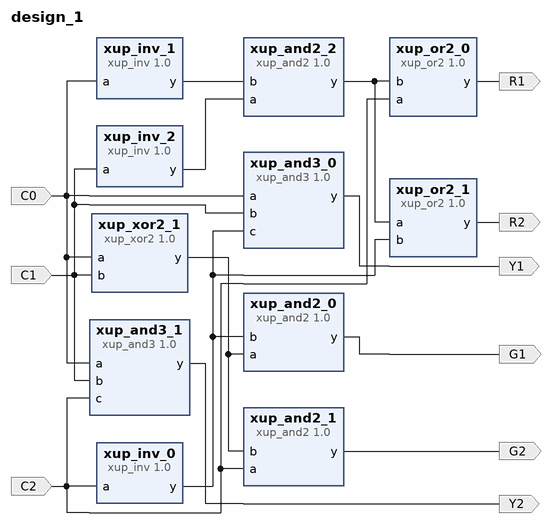
[diagram p0: block diagram of the top level]
# Vivado block design design_1, xc7a35tcpg236-1, Vivado 2023.2
create_bd_design design_1

create_bd_port -dir I C0
create_bd_port -dir I C1
create_bd_port -dir I C2
create_bd_port -dir O G1
create_bd_port -dir O G2
create_bd_port -dir O Y1
create_bd_port -dir O Y2
create_bd_port -dir O R1
create_bd_port -dir O R2

create_bd_cell -type ip -vlnv xilinx.com:xup:xup_inv:1.0 xup_inv_0
create_bd_cell -type ip -vlnv xilinx.com:xup:xup_and2:1.0 xup_and2_0
create_bd_cell -type ip -vlnv xilinx.com:xup:xup_xor2:1.0 xup_xor2_1
create_bd_cell -type ip -vlnv xilinx.com:xup:xup_and2:1.0 xup_and2_1
create_bd_cell -type ip -vlnv xilinx.com:xup:xup_and3:1.0 xup_and3_0
create_bd_cell -type ip -vlnv xilinx.com:xup:xup_and3:1.0 xup_and3_1
create_bd_cell -type ip -vlnv xilinx.com:xup:xup_inv:1.0 xup_inv_1
create_bd_cell -type ip -vlnv xilinx.com:xup:xup_inv:1.0 xup_inv_2
create_bd_cell -type ip -vlnv xilinx.com:xup:xup_and2:1.0 xup_and2_2
create_bd_cell -type ip -vlnv xilinx.com:xup:xup_or2:1.0 xup_or2_0
create_bd_cell -type ip -vlnv xilinx.com:xup:xup_or2:1.0 xup_or2_1

# ---- connections ----

connect_bd_net -net a_0_1 [get_bd_ports C0] [get_bd_pins xup_xor2_1/a] [get_bd_pins xup_and3_0/a] [get_bd_pins xup_and3_1/a] [get_bd_pins xup_inv_1/a]
connect_bd_net -net a_0_2 [get_bd_ports C2] [get_bd_pins xup_inv_0/a] [get_bd_pins xup_and2_1/a] [get_bd_pins xup_and3_1/c] [get_bd_pins xup_or2_0/a]
connect_bd_net -net b_0_1 [get_bd_ports C1] [get_bd_pins xup_xor2_1/b] [get_bd_pins xup_and3_0/b] [get_bd_pins xup_and3_1/b] [get_bd_pins xup_inv_2/a]
connect_bd_net [get_bd_pins xup_and2_0/y] [get_bd_ports G1]
connect_bd_net [get_bd_pins xup_and2_1/y] [get_bd_ports G2]
connect_bd_net [get_bd_pins xup_and2_2/y] [get_bd_pins xup_or2_0/b] [get_bd_pins xup_or2_1/a]
connect_bd_net [get_bd_pins xup_and3_0/y] [get_bd_ports Y1]
connect_bd_net [get_bd_pins xup_and3_1/y] [get_bd_ports Y2]
connect_bd_net [get_bd_pins xup_inv_0/y] [get_bd_pins xup_and2_0/b] [get_bd_pins xup_and3_0/c] [get_bd_pins xup_or2_1/b]
connect_bd_net [get_bd_pins xup_inv_1/y] [get_bd_pins xup_and2_2/b]
connect_bd_net [get_bd_pins xup_inv_2/y] [get_bd_pins xup_and2_2/a]
connect_bd_net [get_bd_pins xup_or2_0/y] [get_bd_ports R1]
connect_bd_net [get_bd_pins xup_or2_1/y] [get_bd_ports R2]
connect_bd_net [get_bd_pins xup_xor2_1/y] [get_bd_pins xup_and2_1/b] [get_bd_pins xup_and2_0/a]

validate_bd_design
save_bd_design
